# Altium schematic sheet USB.SchDoc
size A; DocumentNumber: 8; SheetNumber: 8
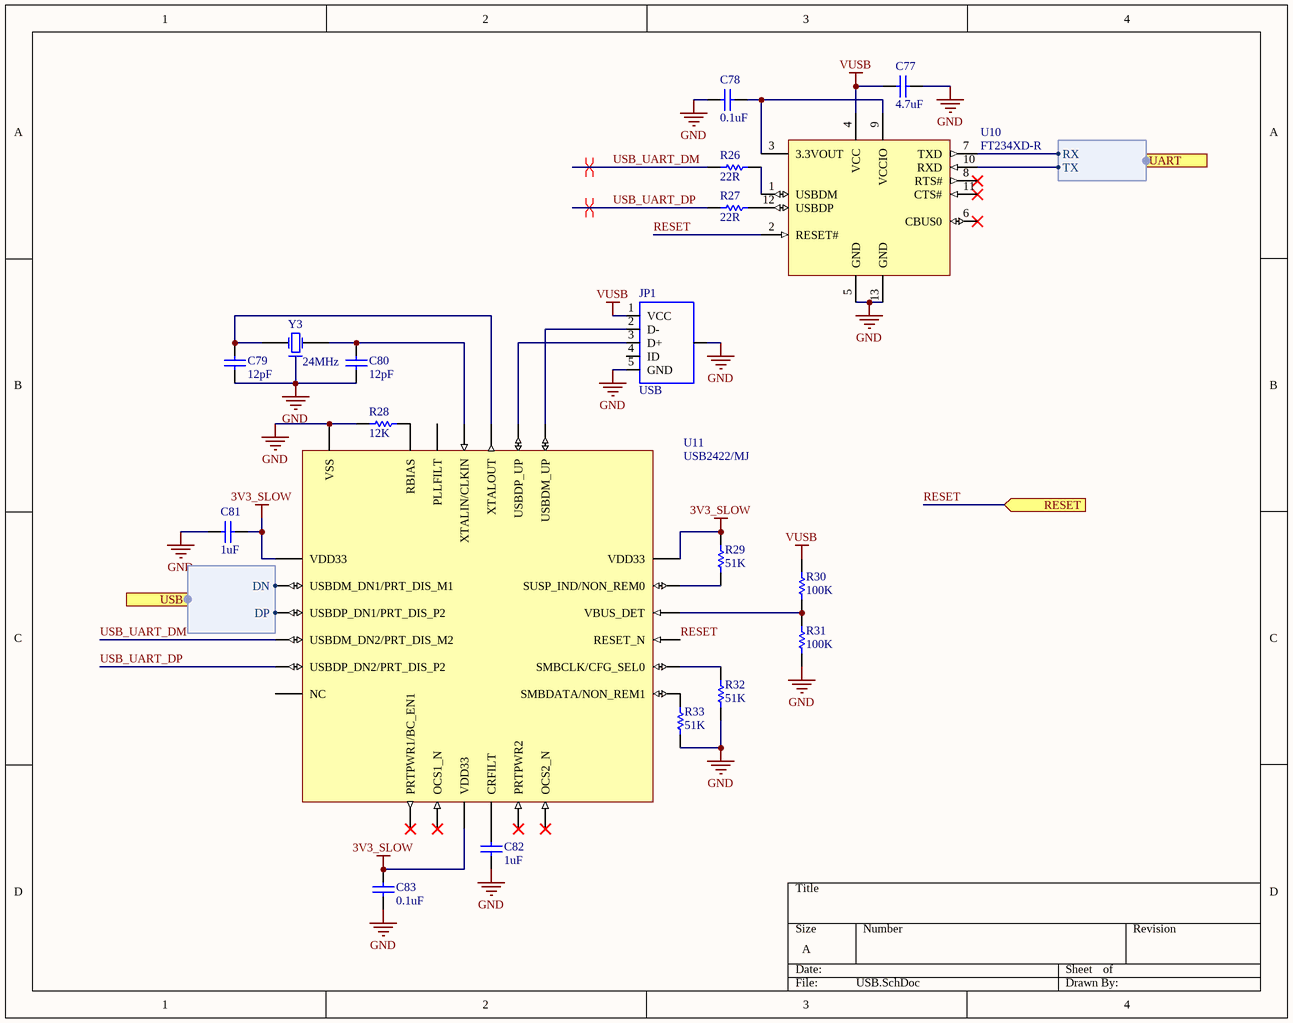
[diagram p0: USB.SchDoc]

## Parts
C77  value 4.7uF  [C0402[1005X55]]  (hidden comment: 4.7uF 6.3V 0402)
C78  value 0.1uF  [C0402[1005X55]]  (hidden comment: 0.1uF 6.3V 0402)
C79  value 12pF  [C0402[1005X55]]  (hidden comment: 12pF 50V 0402)
C80  value 12pF  [C0402[1005X55]]  (hidden comment: 12pF 50V 0402)
C81  value 1uF  [C0402[1005X55]]  (hidden comment: 1uF 6.3V 0402)
C82  value 1uF  [C0402[1005X55]]  (hidden comment: 1uF 6.3V 0402)
C83  value 0.1uF  [C0402[1005X55]]  (hidden comment: 0.1uF 6.3V 0402)
JP1  USB  [USB-MICROB]
R26  value 22R  [R0402[1005]]  (hidden comment: 22R 1% 0402)
R27  value 22R  [R0402[1005]]  (hidden comment: 22R 1% 0402)
R28  value 12K  [R0402[1005]]  (hidden comment: 12K 1% 0402)
R29  value 51K  [R0402[1005]]  (hidden comment: 51K 1% 0402)
R30  value 100K  [R0402[1005]]  (hidden comment: 100K 1% 0402)
R31  value 100K  [R0402[1005]]  (hidden comment: 100K 1% 0402)
R32  value 51K  [R0402[1005]]  (hidden comment: 51K 1% 0402)
R33  value 51K  [R0402[1005]]  (hidden comment: 51K 1% 0402)
U10  FT234XD-R  [DFN-12]
U11  USB2422/MJ  [QFN-24 (4x4MM)]
Y3  24MHz  [CRYSTAL_2.0x1.6]

## Ports
RESET (in), UART (harness UART), USB (harness USB)

## Harnesses
USB: DN, DP
UART: TX, RX

## Nets
3V3_SLOW: C81.2 C83.2 R29.2 U11.1(VDD33) U11.9(VDD33) U11.18(VDD33)
GND: C77.2 C78.2 C79.1 C80.1 C81.1 C82.1 C83.1 JP1.5(GND) JP1.6(SHIELD) R28.1 R31.1 R32.1 R33.1 U10.5(GND) U10.13(GND) U11.25(VSS) Y3.2
VUSB: C77.1 JP1.1(VCC) R30.2 U10.4(VCC)
RESET: U10.2(RESET#) U11.15(RESET_N) ; port RESET
USB_UART_DM: R26.1 U11.4(USBDM_DN2/PRT_DIS_M2)
USB_UART_DP: R27.1 U11.5(USBDP_DN2/PRT_DIS_P2)
NetC78_1: C78.1 U10.3(3.3VOUT) U10.9(VCCIO)
NetC79_2: C79.2 U11.21(XTALOUT) Y3.1(X1)
NetC80_2: C80.2 U11.22(XTALIN/CLKIN) Y3.3(X2)
NetC82_2: C82.2 U11.10(CRFILT)
NetJP1_2: JP1.2(D-) U11.19(USBDM_UP)
NetJP1_3: JP1.3(D+) U11.20(USBDP_UP)
NetR26_2: R26.2 U10.1(USBDM)
NetR27_2: R27.2 U10.12(USBDP)
NetR28_2: R28.2 U11.24(RBIAS)
NetR29_1: R29.1 U11.17(SUSP_IND/NON_REM0)
NetR30_1: R30.1 R31.2 U11.16(VBUS_DET)
NetR32_2: R32.2 U11.14(SMBCLK/CFG_SEL0)
NetR33_2: R33.2 U11.13(SMBDATA/NON_REM1)
NetU10_7: U10.7(TXD) ; port UART.RX
NetU10_10: U10.10(RXD) ; port UART.TX
NetU11_2: U11.2(USBDM_DN1/PRT_DIS_M1) ; port USB.DN
NetU11_3: U11.3(USBDP_DN1/PRT_DIS_P2) ; port USB.DP

Not connected (* = marked no-connect by the designer): JP1 4(ID); U10 6(CBUS0)* 8(RTS#)* 11(CTS#)*; U11 6(NC) 7(PRTPWR1/BC_EN1)* 8(OCS1_N)* 11(PRTPWR2)* 12(OCS2_N)* 23(PLLFILT)

## Layout directives
differential pair: USB_UART_DM, USB_UART_DP

## Library data of the parts
C77 = CAP_4.7uF_6.3V_0402_20%: 4.7uF 6.3V 20% 0402 (1005 Metric); PartNumber: GRM155R60J475ME47D; Manufacturer: Murata; Mounting Technology: Surface Mount; PackageReference: 0402; PackageDescription: 0402 (1005 Metric); Voltage: 6.3V; Tolerance: 20%
C78 C83 = CAP_0.1uF_6.3V_0402_10%: 0.1uF 6.3V 10% 0402 (1005 Metric); PartNumber: GRM155R70J104KA01D; Manufacturer: Murata; Mounting Technology: Surface Mount; PackageReference: 0402; PackageDescription: 0402 (1005 Metric); Voltage: 6.3V; Tolerance: 10%
C79 C80 = CAP_12pF_50V_0402_5%: 12pF 50V 5% 0402 (1005 Metric); PartNumber: GRM1555C1H120JA01D; Manufacturer: Murata; Mounting Technology: Surface Mount; PackageReference: 0402; PackageDescription: 0402 (1005 Metric); Voltage: 50V; Tolerance: 5%
C81 C82 = CAP_1uF_6.3V_0402_10%: 1uF 6.3V 10% 0402 (1005 Metric); PartNumber: GRM155R70J105KA12D; Manufacturer: Murata; Mounting Technology: Surface Mount; PackageReference: 0402; PackageDescription: 0402 (1005 Metric); Voltage: 6.3V; Tolerance: 10%
JP1 = USB_MICROB_SMT: pin to pad: 1>VBUS 2>D- 3>D+ 4>ID 5>GND 6>MT1+P$1+P$2+MT2; PartNumber: 10118192-0001LF; Manufacturer: Amphenol FCI; Mounting Technology: Surface Mount; PackageReference: USB - Micro B
R26 R27 = RES_22R_0402_1%: 22R 0.063W 1% 0402 (1005 Metric); Manufacturer: KOA Speer; PartNumber: RK73H1ETTP22R0F; Tolerance: 1%; Power: 0.063W; Mounting Technology: Surface Mount; PackageReference: 0402; PackageDescription: 0402 (1005 Metric); ComponentLink1Description: Datasheet; ComponentLink1URL: http://www.koaspeer.com/catimages/Products/RK73H/RK73H.pdf
R28 = RES_12K_0402_1%: 12K 0.063W 1% 0402 (1005 Metric); Manufacturer: KOA Speer; PartNumber: RK73H1ETTP1202F; Tolerance: 1%; Power: 0.063W; Mounting Technology: Surface Mount; PackageReference: 0402; PackageDescription: 0402 (1005 Metric); ComponentLink1Description: Datasheet; ComponentLink1URL: http://www.koaspeer.com/catimages/Products/RK73H/RK73H.pdf
R29 R32 R33 = RES_51K_0402_1%: 51K 0.063W 1% 0402 (1005 Metric); Manufacturer: KOA Speer; PartNumber: RK73H1ETTP5102F; Tolerance: 1%; Power: 0.063W; Mounting Technology: Surface Mount; PackageReference: 0402; PackageDescription: 0402 (1005 Metric); ComponentLink1Description: Datasheet; ComponentLink1URL: http://www.koaspeer.com/catimages/Products/RK73H/RK73H.pdf
R30 R31 = RES_100K_0402_1%: 100K 0.063W 1% 0402 (1005 Metric); Manufacturer: KOA Speer; PartNumber: RK73H1ETTP1003F; Tolerance: 1%; Power: 0.063W; Mounting Technology: Surface Mount; PackageReference: 0402; PackageDescription: 0402 (1005 Metric); ComponentLink1Description: Datasheet; ComponentLink1URL: http://www.koaspeer.com/catimages/Products/RK73H/RK73H.pdf
U10 = FT234XD-R: USB Interface IC USB to Serial UART Interface; Manufacturer: FTDI; PartNumber: FT234XD-R; PackageReference: DFN-12; Mounting Technology: Surface Mount
U11 = USB2422/MJ: USB Hub IC 2-Port; Manufacturer: Microchip; PartNumber: USB2422/MJ; PackageReference: QFN-24; Mounting Technology: Surface Mount
Y3 = FA-128 24.0000MF10Z-W3: Manufacturer: EPSON; PartNumber: FA-128 24.0000MF10Z-W3; Mounting Technology: Surface Mount; PackageReference: 4-SMD